# EAGLE design sticky-watch-v1.5 (EAGLE 7.6.0)
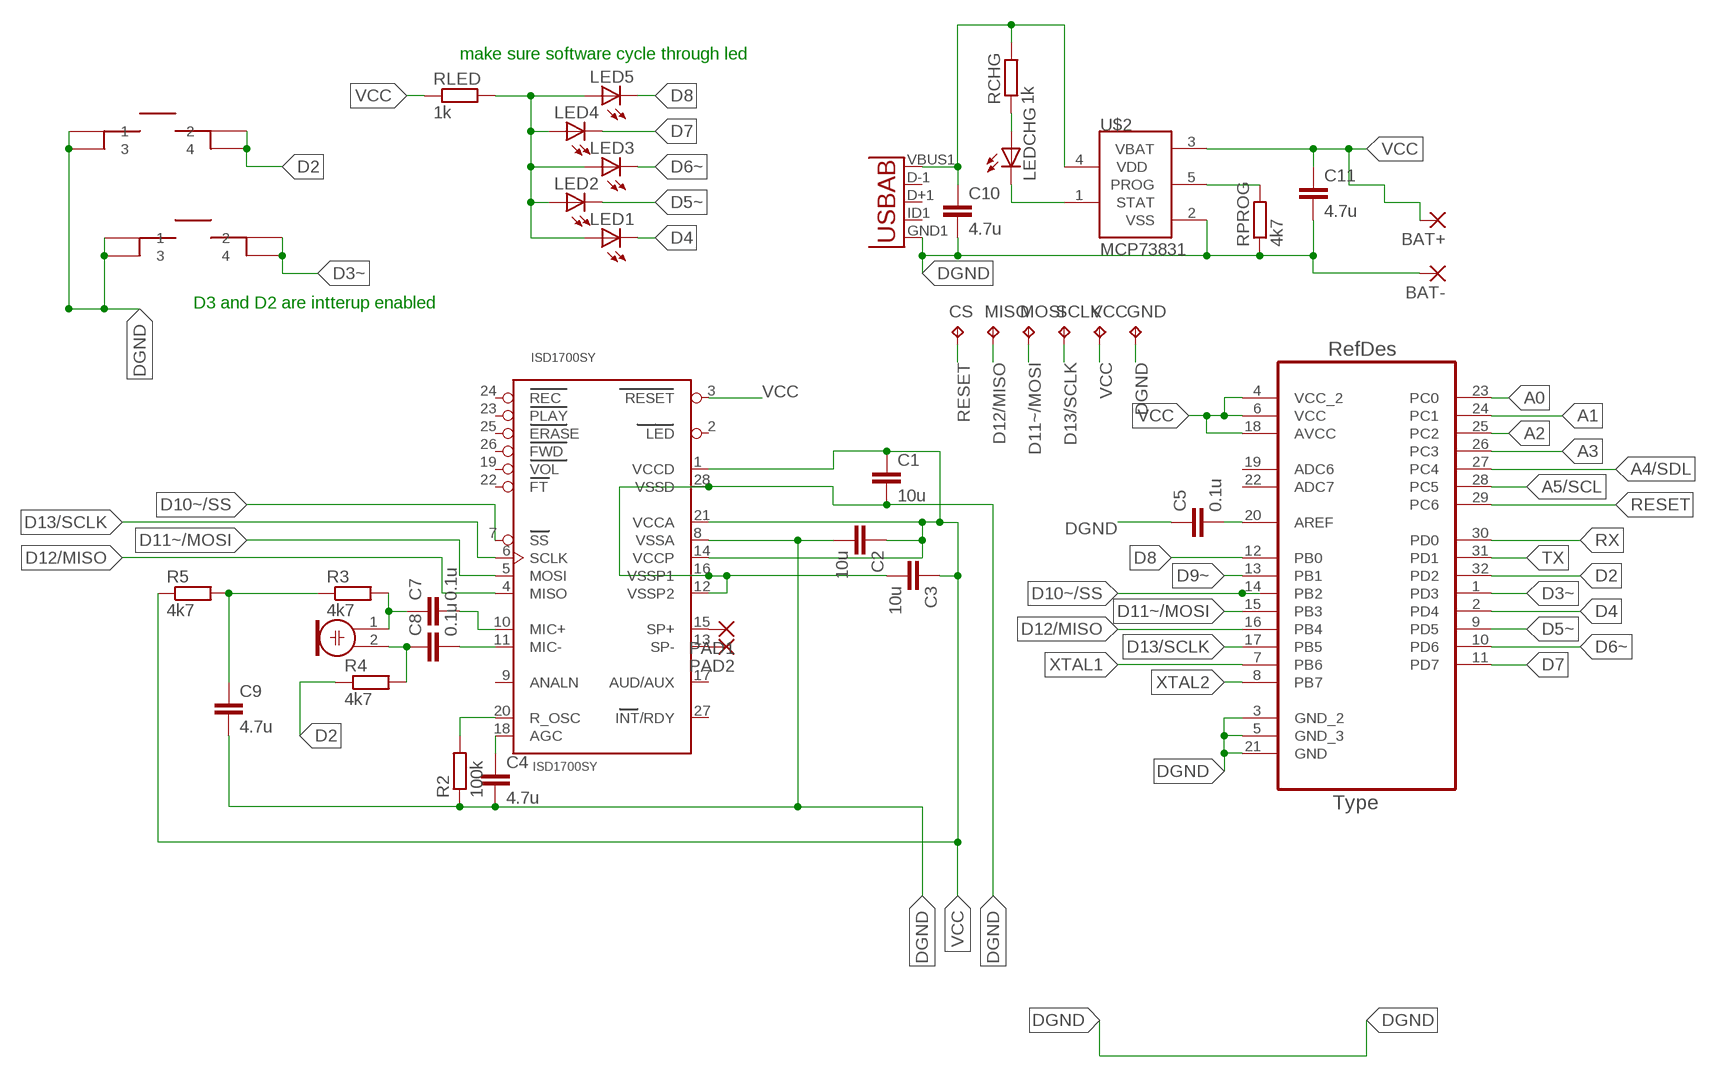
[diagram p0: schematic, sheet 1]

## Parts
BAT+  1,6/0,8  [1,6/0,8]
BAT-  1,6/0,8  [1,6/0,8]
C1  10u  C-EUC0603  [C0603]
C2  10u  C-EUC0603  [C0603]
C3  10u  C-EUC0603  [C0603]
C4  4.7u  C-EUC0603  [C0603]
C5  0.1u  C-EUC0603  [C0603]
C7  0.1u  C-EUC0603  [C0603]
C8  0.1u  C-EUC0603  [C0603]
C9  4.7u  C-EUC0603  [C0603]
C10  4.7u  C-EUC0603  [C0603]
C11  4.7u  C-EUC0603  [C0603]
CS  TPTP10R  [TP10R]
GND  TPTP10R  [TP10R]
ISD1700SY  ISD1700SY  [SO28W]
LED1  LEDSML0805  [SML0805]
LED2  LEDSML0805  [SML0805]
LED3  LEDSML0805  [SML0805]
LED4  LEDSML0805  [SML0805]
LED5  LEDSML0805  [SML0805]
LEDCHG  LEDSML0805  [SML0805]
M1  ELECTRET_MICROPHON-WM-63PR  [WM-63PR]
MISO  TPTP10R  [TP10R]
MOSI  TPTP10R  [TP10R]
PAD1  1,6/0,8  [1,6/0,8]
PAD2  1,6/0,8  [1,6/0,8]
R2  100k  R-EU_R0603  [R0603]
R3  4k7  R-EU_R0603  [R0603]
R4  4k7  R-EU_R0603  [R0603]
R5  4k7  R-EU_R0603  [R0603]
RCHG  1k  R-EU_R0603  [R0603]
RLED  1k  R-EU_R0603  [R0603]
RPROG  4k7  R-EU_R0603  [R0603]
S1  0  SMD-TACT  [SMD-TACT-5.2MM]
S2  SMD-TACT  [SMD-TACT-5.2MM]
SCLK  TPTP10R  [TP10R]
U1  ATMEGA328P-AU  [QFP80P900X900X120-32N]
U2  USB""  [USB-MICRO-SMD]
U$2  MCP73831  [SOT23-5L]
VCC  TPTP10R  [TP10R]

## Nets
A0: U1.23(PC0)
A1: U1.24(PC1)
A2: U1.25(PC2)
A3: U1.26(PC3)
A4/SDL: U1.27(PC4)
A5/SCL: U1.28(PC5)
D2: R4.1 S2.2 S2.4 U1.32(PD2)
D3~: S1.2 S1.4 U1.1(PD3)
D4: LED1.C U1.2(PD4)
D5~: LED2.C U1.9(PD5)
D6~: LED3.C U1.10(PD6)
D7: LED4.C U1.11(PD7)
D8: LED5.C U1.12(PB0)
D9~: U1.13(PB1)
D10~/SS: ISD1700SY.7(SS) U1.14(PB2)
D11~/MOSI: ISD1700SY.5(MOSI) MOSI.TP U1.15(PB3)
D12/MISO: ISD1700SY.4(MISO) MISO.TP U1.16(PB4)
D13/SCLK: ISD1700SY.6(SCLK) SCLK.TP U1.17(PB5)
DGND: BAT-.1(P) C1.2 C2.2 C3.2 C4.2 C5.1 C9.2 C10.2 C11.2 GND.TP ISD1700SY.8(VSSA) ISD1700SY.12(VSSP2) ISD1700SY.16(VSSP1) ISD1700SY.28(VSSD) R2.1 RPROG.1 S1.1 S1.3 S2.1 S2.3 U1.3(GND_2) U1.5(GND_3) U1.21(GND) U2.GND1(GND) U$2.2(VSS)
N$1: LED1.A LED2.A LED3.A LED4.A LED5.A RLED.2
N$2: C10.1 RCHG.2 U2.VBUS1(VBUS) U$2.4(VDD)
N$3: ISD1700SY.15(SP+) PAD1.1(P)
N$4: LEDCHG.A RCHG.1
N$5: C7.2 ISD1700SY.10(MIC+)
N$6: LEDCHG.C U$2.1(STAT)
N$7: C5.2 U1.20(AREF)
N$9: ISD1700SY.13(SP-) PAD2.1(P)
N$10: C4.1 ISD1700SY.18(AGC)
N$11: ISD1700SY.20(R_OSC) R2.2
N$13: C8.2 ISD1700SY.11(MIC-)
N$14: C8.1 M1.2 R4.2
N$15: RPROG.2 U$2.5(PROG)
N$16: C9.1 R3.1 R5.2
N$18: C7.1 M1.1 R3.2
RESET: CS.TP U1.29(PC6)
RX: U1.30(PD0)
TX: U1.31(PD1)
VCC: BAT+.1(P) C1.1 C2.1 C3.1 C11.1 ISD1700SY.1(VCCD) ISD1700SY.3(RESET) ISD1700SY.14(VCCP) ISD1700SY.21(VCCA) R5.1 RLED.1 U1.4(VCC_2) U1.6(VCC) U1.18(AVCC) U$2.3(VBAT) VCC.TP
XTAL1: U1.7(PB6)
XTAL2: U1.8(PB7)
Unconnected: ISD1700SY.2(LED) ISD1700SY.9(ANALN) ISD1700SY.17(AUD/AUX) ISD1700SY.19(VOL) ISD1700SY.22(FT) ISD1700SY.23(PLAY) ISD1700SY.24(REC) ISD1700SY.25(ERASE) ISD1700SY.26(FWD) ISD1700SY.27(INT/RDY) U1.19(ADC6) U1.22(ADC7) U2.D+1(D+) U2.D-1(D-) U2.ID1(USBID)

## Notes on the sheet
- make sure software cycle through led
- D3 and D2 are intterup enabled

## Library data of the parts
BAT+ BAT- PAD1 PAD2 = wirepad:1,6/0,8: THROUGH-HOLE PAD
C1-C5 C7-C11 = rcl:C-EU: CAPACITOR, European symbol
CS GND MISO MOSI SCLK VCC = testpad:TP: Test pad
ISD1700SY = isd-new-1:ISD1700
LED1-LED5 LEDCHG = led:LED: LED OSRAM: - CHIPLED LG R971, LG N971, LY N971, LG Q971, LY Q971, LO R971, LY R971 LH N974, LH R974 LS Q976, LO Q976, LY Q976 LO Q996 - Hyper CHIPLED LW Q18S LB Q993, LB Q99A, LB R99A - SideLED LS A670, LO A670, LY A670, LG A670, LP A670 LB A673, LV A673, LT A673, LW A673 LH A674 LY A675 LS A676, LA A676, LO A676, LY A676, LW A676 LS A679, LY A679, LG A679 - Hyper Micro SIDELED® LS Y876, LA Y876, LO Y876, LY Y876 LT Y87S - SmartLED LW L88C, LW L88S LB L89C, LB L89S, LG L890 LS L89K, LO L89K, LY L89K LS L896, LA L896, LO L896, LY L896 - TOPLED LS T670, LO T670, LY T670, LG T670, LP T670 LSG T670, LSP T670, LSY T670, LOP T670, LYG T670 LG T671, LOG T671, LSG T671 LB T673, LV T673, LT T673, LW T673 LH T674 LS T676, LA T676, LO T676, LY T676, LB T676, LH T676, LSB T676, LW T676 LB T67C, LV T67C, LT T67C, LS T67K, LO T67K, LY T67K, LW E67C LS E67B, LA E67B, LO E67B, LY E67B, LB E67C, LV E67C, LT E67C LW T67C LS T679, LY T679, LG T679 LS T770, LO T770, LY T770, LG T770, LP T770 LB T773, LV T773, LT T773, LW T773 LH T774 LS E675, LA E675, LY E675, LS T675 LS T776, LA T776, LO T776, LY T776, LB T776 LHGB T686 LT T68C, LB T68C - Hyper Mini TOPLED® LB M676 - Mini TOPLED Santana® LG M470 LS M47K, LO M47K, LY M47K Source: http://www.osram.convergy.de LUXEON: - LUMILED® LXK2-PW12-R00, LXK2-PW12-S00, LXK2-PW14-U00, LXK2-PW14-V00 LXK2-PM12-R00, LXK2-PM12-S00, LXK2-PM14-U00 LXK2-PE12-Q00, LXK2-PE12-R00, LXK2-PE12-S00, LXK2-PE14-T00, LXK2-PE14-U00 LXK2-PB12-K00, LXK2-PB12-L00, LXK2-PB12-M00, LXK2-PB14-N00, LXK2-PB14-P00, LXK2-PB14-Q00 LXK2-PR12-L00, LXK2-PR12-M00, LXK2-PR14-Q00, LXK2-PR14-R00 LXK2-PD12-Q00, LXK2-PD12-R00, LXK2-PD12-S00 LXK2-PH12-R00, LXK2-PH12-S00 LXK2-PL12-P00, LXK2-PL12-Q00, LXK2-PL12-R00 Source: www.luxeon.com KINGBRIGHT: KA-3528ASYC Source: www.kingbright.com
M1 = microphon:ELECTRET_MICROPHON-: Electret Condenser Microphone
R2-R5 RCHG RLED RPROG = rcl:R-EU_: RESISTOR, European symbol
S1 S2 = proto-lab:SMD-TACT
U1 = Atmel-ATMEGA328P-AU:ATMEGA328P-AU; DESCRIPTION: 8-bit Microcontroller with In-System Programmable Flash; MPN: ATMEGA328P-AU; OC_FARNELL: 1715486; OC_NEWARK: 14R4631; PACKAGE: TQFP-32; SUPPLIER: Atmel
U2 = MicroUSB:USB: This is a USB AB connector that is compatible with USB OTG. i.e. this connector can serve as a host or device
U$2 =  MCP73831:MCP73831: Miniature Single-Cell, Fully Integrated Li-Ion, Li-Polymer Charge Management Controllers

## Board
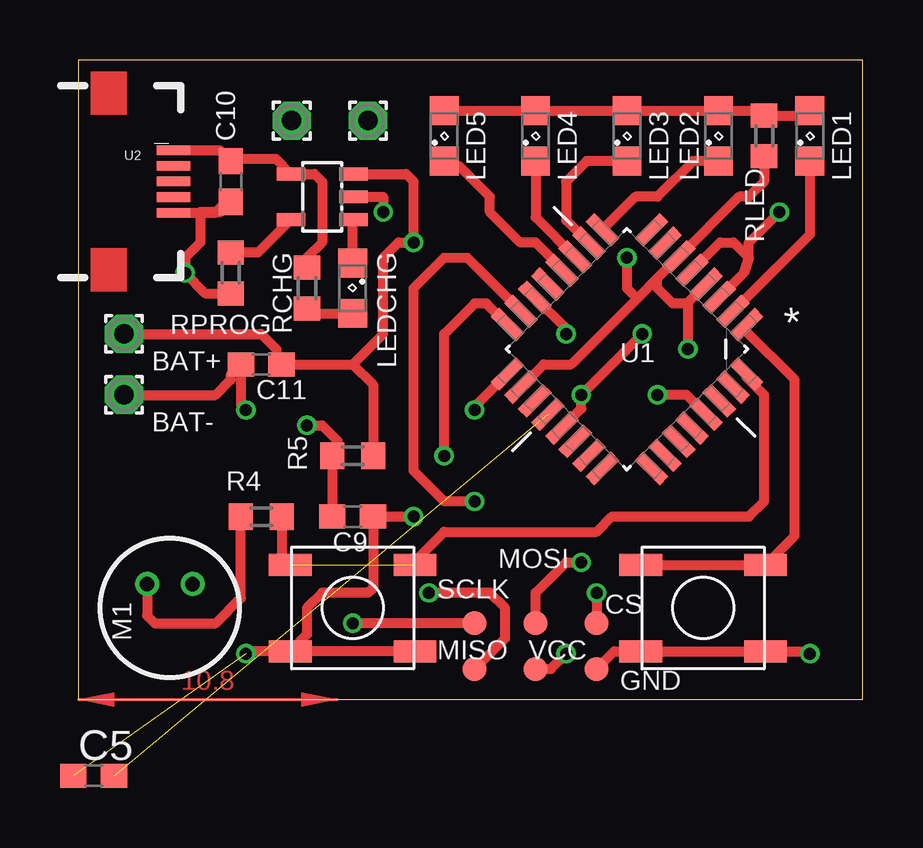
[diagram p1: board, top side]
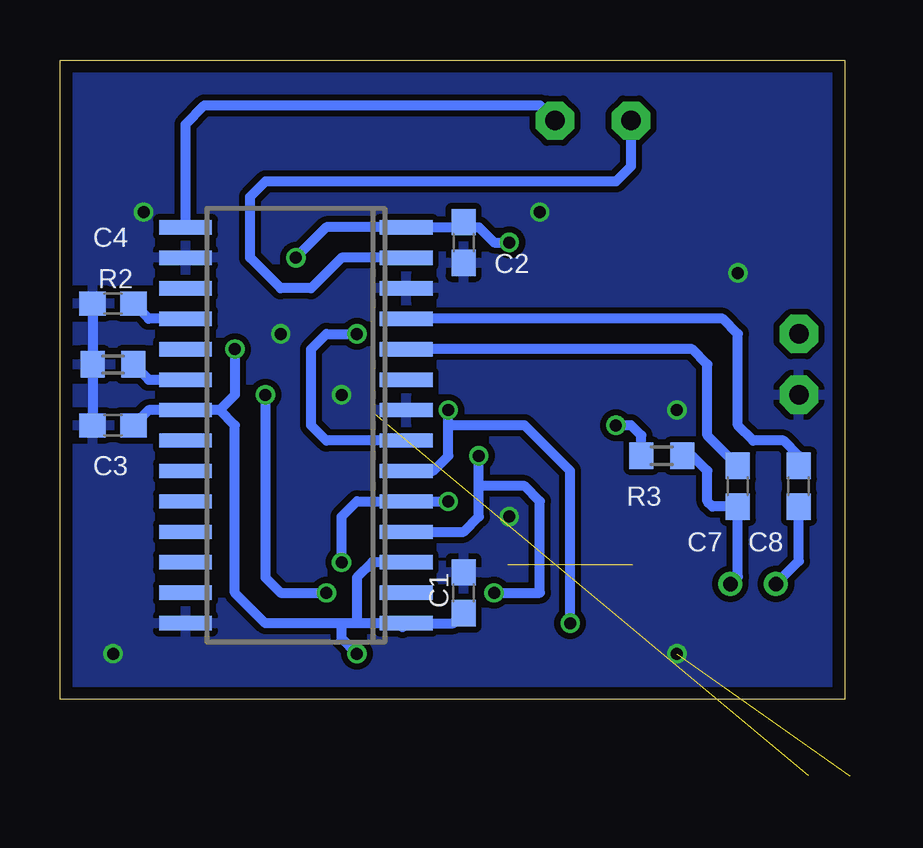
[diagram p2: board, bottom side, seen from below]

Size 32.69 x 26.66 mm. Coordinates in mm from the lower left corner, seen from the top.
Outline: 0,0 32.69,0 32.69,26.66 0,26.66 0,0
Copper layers (1*16): Top 0.035mm / dielectric 1.6mm / Bottom 0.035mm
Design rules "Elecrow_2-layer_PCB_eagle_rule": minimum track width 6mil, minimum drill 12mil, track to track 6mil, track to pad 6mil, pad to pad 6mil, via to via 8mil, smd to smd 0mil, copper to edge 20mil, drill to drill 10mil, minimum pad ring 6mil, minimum via ring 6mil, stop-mask expansion 0mil, vias tented up to drill 100mil, thermal gap 10mil

### Footprints (pad centres in the part's own frame; a part is rotated, then mirrored left to right if it is on the bottom)
1,6/0,8 = drill 0.813 pad 1.6 octagon: 1 0,0
C0603 = smd 1.1 x 1: 1 -0.85,0; 2 0.85,0
TP10R = smd 1 x 1: TP 0,0
SO28W = smd 0.6 x 2.2: 1 -8.255,-4.6; 2 -6.985,-4.6; 3 -5.715,-4.6; 4 -4.445,-4.6; 5 -3.175,-4.6; 6 -1.905,-4.6; 7 -0.635,-4.6; 8 0.635,-4.6; 9 1.905,-4.6; 10 3.175,-4.6; 11 4.445,-4.6; 12 5.715,-4.6; 13 6.985,-4.6; 14 8.255,-4.6; 15 8.255,4.6; 16 6.985,4.6; 17 5.715,4.6; 18 4.445,4.6; 19 3.175,4.6; 20 1.905,4.6; 21 0.635,4.6; 22 -0.635,4.6; 23 -1.905,4.6; 24 -3.175,4.6; 25 -4.445,4.6; 26 -5.715,4.6; 27 -6.985,4.6; 28 -8.255,4.6
SML0805 = smd 1.2 x 1.2: A 1.05,0; C -1.05,0
WM-63PR = drill 0.6 pad 1: 1 -1,0.95; 2 -1,-0.95
R0603 = smd 1 x 1.1: 1 -0.85,0; 2 0.85,0
SMD-TACT-5.2MM = smd 1.778 x 0.914: 1 -2.6,1.8; 2 -2.6,-1.8; 3 2.6,1.8; 4 2.6,-1.8
QFP80P900X900X120-32N = smd 1.473 x 0.508: 1 -4.242,2.794; 2 -4.242,2.007; 3 -4.242,1.194; 4 -4.242,0.406; 5 -4.242,-0.406; 6 -4.242,-1.194; 7 -4.242,-2.007; 8 -4.242,-2.794; 17 4.242,-2.794; 18 4.242,-2.007; 19 4.242,-1.194; 20 4.242,-0.406; 21 4.242,0.406; 22 4.242,1.194; 23 4.242,2.007; 24 4.242,2.794 | smd 0.508 x 1.473: 9 -2.794,-4.242; 10 -2.007,-4.242; 11 -1.194,-4.242; 12 -0.406,-4.242; 13 0.406,-4.242; 14 1.194,-4.242; 15 2.007,-4.242; 16 2.794,-4.242; 25 2.794,4.242; 26 2.007,4.242; 27 1.194,4.242; 28 0.406,4.242; 29 -0.406,4.242; 30 -1.194,4.242; 31 -2.007,4.242; 32 -2.794,4.242
USB-MICRO-SMD = smd 1.4 x 0.4: D+1 2.7,0; D-1 2.7,0.65; GND1 2.7,-1.3; ID1 2.7,-0.65; VBUS1 2.7,1.3
SOT23-5L = smd 0.533 x 1.2: 1 -0.95,-1.3; 2 0,-1.3; 3 0.95,-1.3 | smd 0.55 x 1.2: 4 0.95,1.3; 5 -0.95,1.3

### Placement (x,y rotation side)
BAT+  1.91,15.24 0 top
BAT-  1.91,12.7 0 top
C1  15.88,4.45 90 bottom
C2  15.88,19.05 270 bottom
C3  30.48,11.43 180 bottom
C4  30.48,16.51 180 bottom
C5  0.64,-3.18 0 top  (outside the outline)
C7  4.45,8.89 90 bottom
C8  1.91,8.89 90 bottom
C9  11.43,7.62 0 top
C10  6.35,21.59 270 top
C11  7.62,13.97 180 top
CS  21.59,3.17 0 top
GND  21.59,1.27 0 top
ISD1700SY  22.86,11.43 90 bottom
LED1  30.48,23.49 90 top
LED2  26.67,23.49 90 top
LED3  22.86,23.49 90 top
LED4  19.05,23.49 90 top
LED5  15.24,23.49 90 top
LEDCHG  11.43,17.14 270 top
M1  3.81,3.81 270 top
MISO  16.51,1.27 0 top
MOSI  19.05,3.17 0 top
PAD1  12.07,24.13 0 top
PAD2  8.89,24.13 0 top
R2  30.48,13.97 0 bottom
R3  7.62,10.16 0 bottom
R4  7.62,7.62 180 top
R5  11.43,10.16 180 top
RCHG  9.52,17.14 90 top
RLED  28.58,23.49 90 top
RPROG  6.35,17.78 90 top
S1  26.04,3.81 180 top
S2  11.43,3.81 180 top
SCLK  16.51,3.17 0 top
U1  22.86,14.6 225 top
U2  1.27,21.59 0 top
U$2  10.16,20.95 90 top
VCC  19.05,1.27 0 top

### Tracks (layer width: path | path; a pad name or v marks a point on that pad's centre or on a via)
D2  (1 unrouted)
  Top 0.406: R4.1 8.47,5.97 S2.4 | U1.32 27.84,13.44 28.58,12.7 28.58,8.25 27.94,7.62 22.23,7.62 21.59,6.98 15.24,6.98 14.03,5.77 S2.2
D3~
  Top 0.406: U1.1 27.84,15.34 29.84,13.34 29.84,6.82 S1.2 S1.4
D4
  Top 0.406: LED1.C 30.48,19.39 U1.2
D5~
  Top 0.406: LED2.C 25.62,22.45 24.13,20.95 23.21,20.95 U1.9
D6~
  Top 0.406: LED3.C 21.18,22.45 20.32,21.59 20.32,19.98 U1.10
D7
  Top 0.406: LED4.C 19.05,20.1 U1.11
D8
  Top 0.406: U1.12 20.15,17.95 19.05,19.05 18.41,19.05 17.15,20.32 17.15,20.95 15.88,22.23 15.46,22.23 LED5.C
D10~/SS  (via drill 0.5)
  Top 0.406: v20.32,15.24 20.32,15.46 U1.14
  Bottom 0.406: ISD1700SY.7 21.59,10.8 22.23,11.43 22.23,14.6 21.59,15.24 v20.32,15.24
D11~/MOSI  (via drill 0.5)
  Top 0.406: v16.51,8.25 15.24,8.25 13.97,9.52 13.97,17.14 15.24,18.41 16.21,18.41 U1.15 | MOSI.TP 19.05,4.45 20.32,5.71 v20.95,5.71
  Bottom 0.406: v16.51,8.25 ISD1700SY.5 20.32,8.25 20.95,7.62 v20.95,5.71
D12/MISO  (via drill 0.5)
  Top 0.406: v15.24,10.16 15.24,15.24 16.51,16.51 17,16.51 U1.16 | MISO.TP 17.78,2.54 17.78,3.81 17.15,4.45 v14.61,4.45
  Bottom 0.406: ISD1700SY.4 15.88,6.98 15.24,7.62 15.24,8.89 | 15.24,8.89 v15.24,10.16 | v14.61,4.45 12.7,4.45 12.7,8.25 13.34,8.89 15.24,8.89
D13/SCLK  (via drill 0.5)
  Top 0.406: v16.51,12.06 16.51,12.21 U1.17 | SCLK.TP v11.43,3.17
  Bottom 0.406: ISD1700SY.6 17.15,9.52 16.51,10.16 16.51,11.43 | 16.51,11.43 v16.51,12.06 | v11.43,3.17 11.43,9.52 13.34,11.43 16.51,11.43
DGND  (via drill 0.5)  (1 unrouted)
  Top 0.406: BAT-.1 5.71,12.7 6.35,13.34 6.35,13.55 C11.2 6.77,12.28 v6.98,12.06 | U2.GND1 5.69,20.29 5.71,20.32 | 5.71,20.32 5.93,20.32 C10.2 6.14,20.74 5.71,20.32 | 5.71,20.32 5.08,20.32 5.08,19.05 4.45,18.41 v4.45,17.78 5.3,16.93 RPROG.1 | v13.97,7.62 C9.2 12.28,4.66 12.07,4.45 10.16,4.45 9.52,3.81 9.52,2.7 S2.3 | v23.5,15.24 v20.95,12.7 20.95,12.12 U1.21 | U1.5 26.73,19.05 27.3,19.05 27.94,18.41 | 27.94,18.41 27.72,17.78 U1.3 | 27.94,18.41 27.94,19.05 v29.21,20.32 | v30.48,1.91 30.38,2.01 S1.1 S1.3 22.33,2.01 GND.TP | S2.1 S2.3 | S2.3 7.09,2.01 v6.98,1.91 | U$2.2 12.7,20.95 v12.7,20.32
  Bottom 0.406: C4.2 R2.1 C3.2
  pour Bottom (isolate 0.254): 0,26.67 33.02,26.67 33.02,0 0,0
N$1
  Top 0.406: LED5.A LED4.A LED3.A LED2.A 28.58,24.55 RLED.2 30.48,24.34 LED1.A
N$2
  Top 0.406: U2.VBUS1 5.9,22.89 C10.1 6.45,22.54 8.23,22.54 U$2.4 9.84,21.91 10.16,21.59 10.16,19.05 9.52,18.41 RCHG.2
N$3
  Bottom 0.406: ISD1700SY.15 27.46,23.98 26.67,24.77 12.7,24.77 PAD1.1
N$4
  Top 0.406: RCHG.1 9.73,16.09 LEDCHG.A
N$5
  Bottom 0.406: ISD1700SY.10 6.35,14.6 5.71,13.97 5.71,11.01 C7.2
N$6
  Top 0.406: LEDCHG.C 11.43,19.98 U$2.1
N$7  (1 unrouted)
N$9
  Bottom 0.406: ISD1700SY.13 20.95,18.41 22.23,17.14 23.5,17.14 24.77,18.41 24.77,20.95 24.13,21.59 9.52,21.59 8.89,22.23 PAD2.1
N$10
  Bottom 0.406: ISD1700SY.18 29,15.88 C4.1
N$11
  Bottom 0.406: R2.2 29,13.34 ISD1700SY.20
N$13
  Bottom 0.406: C8.2 1.91,10.16 2.54,10.8 3.81,10.8 4.45,11.43 4.45,15.24 5.08,15.88 ISD1700SY.11
N$14
  Top 0.406: M1.2 2.86,3.49 3.18,3.17 5.71,3.17 6.77,4.23 R4.2
  Bottom 0.406: M1.2 1.91,5.77 C8.1
N$15
  Top 0.406: U$2.5 7.48,18.63 RPROG.2
N$16  (via drill 0.5)
  Top 0.406: v9.52,11.43 10.16,11.43 10.8,10.8 10.8,10.38 R5.2 C9.1
  Bottom 0.406: R3.1 8.47,11.01 8.89,11.43 v9.52,11.43
N$18
  Bottom 0.406: M1.1 4.45,5.12 C7.1 5.5,8.04 5.71,8.25 5.71,9.52 6.35,10.16 R3.2
RESET  (via drill 0.5)
  Top 0.406: U1.29 25.34,12.7 v24.13,12.7 | v21.59,4.45 CS.TP
  Bottom 0.406: v24.13,12.7 24.13,5.08 23.5,4.45 v21.59,4.45
VCC  (via drill 0.5)
  Top 0.406: RLED.1 28.58,21.59 27.94,20.95 27.52,20.95 U1.6 24.13,17.56 | 11.43,13.97 C11.1 8.26,14.19 8.26,14.6 7.62,15.24 BAT+.1 | 11.43,13.97 12.28,13.12 R5.1 | U1.4 25.34,16.51 | 25.34,16.51 24.77,16.51 24.13,17.14 24.13,17.56 | 24.13,17.56 23.29,16.72 | 23.29,16.72 20.54,13.97 19.39,13.97 U1.18 | 25.34,16.51 25.4,16.45 v25.4,14.6 | v22.86,18.41 22.86,17.14 23.29,16.72 | 11.43,13.97 12.7,15.24 12.7,18.41 13.34,19.05 v13.97,19.05 13.97,21.59 13.66,21.91 U$2.3 | VCC.TP 19.69,1.27 v20.32,1.91
  Bottom 0.406: v25.4,14.6 25.4,12.7 26.04,12.06 | 26.04,12.06 ISD1700SY.21 29,12.06 C3.1 | ISD1700SY.1 20.32,3.17 | 20.32,3.17 20.95,3.17 | 20.95,3.17 24.13,3.17 25.4,4.45 25.4,11.43 26.04,12.06 | ISD1700SY.1 16.3,3.17 C1.1 | v22.86,18.41 21.59,19.69 ISD1700SY.14 16.09,19.69 C2.1 15.66,19.69 15.24,19.69 14.61,19.05 v13.97,19.05 | ISD1700SY.3 19.69,5.71 20.32,5.08 20.32,3.17 | 18.41,3.02 ISD1700SY.1 | v20.32,1.91 20.95,2.54 20.95,3.17
(copper drawn outside any net)
  shapes: Top area x1